# Altium project Shift Relay.PrjPcb
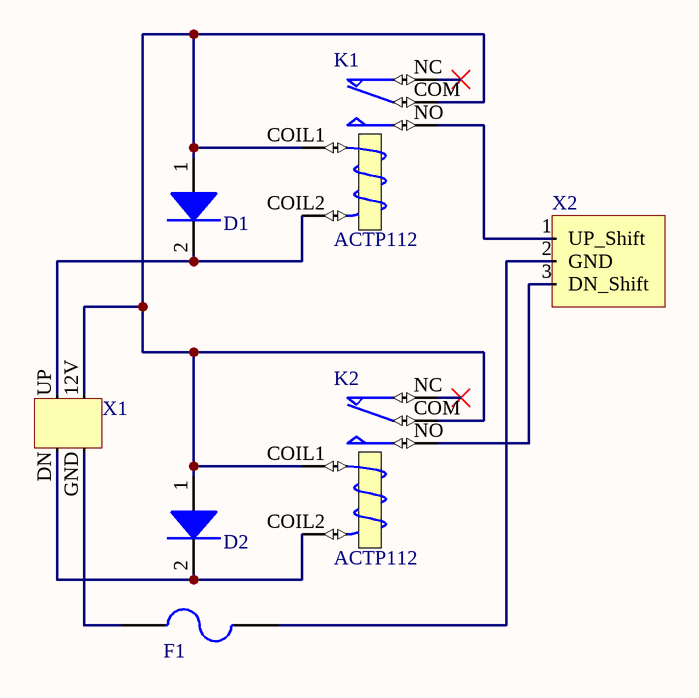
[diagram p0: shift_relays.SchDoc]
1 sheet, 7 parts. Net scope: global (net labels, ports and power ports of the same name join across sheets).

## Sheet shift_relays.SchDoc
size A

### Parts
D1  *  [DO214AA_ SD560BTR]  (value not drawn)
D2  *  [DO214AA_ SD560BTR]  (value not drawn)
F1  Fuse  [3568-MiniFuseHolder]  (value not drawn)
K1  ACTP112  [ACTP112]
K2  ACTP112  [ACTP112]
X1  *  [DTF13-4P]  (value not drawn)
X2  (no value)  [CONN_Shift]

### Nets
NetD1_1: D1.1(A) D2.1(A) K1.COIL1(T1) K1.COM K2.COIL1(T1) K2.COM X1.12V
NetD1_2: D1.2(K) K1.COIL2(T2) X1.UP
NetD2_2: D2.2(K) K2.COIL2(T2) X1.DN
NetF1_1: F1.1 X1.GND
NetF1_2: F1.2 X2.2(GND)
NetK1_NO: K1.NO X2.1(UP_Shift)
NetK2_NO: K2.NO X2.3(DN_Shift)

Not connected (* = marked no-connect by the designer): K1 NC*; K2 NC*

### Library data of the parts
D1 D2 = 18: Diode Standard 600V 5A Surface Mount SMB; id: 18; name: SD560BTR; mfrpartno: *; package: SMB; quantity: 0; link: https://www.digikey.com/product-detail/en/smc-diode-solutions/SD560BTR/1655-1530-1-ND/6022975
F1 = 3: id: 3; Name: 3568 Mini Fuse Holder; itrip: 0; iinterrupt: 0; vmax: 0; quantity: 0; link: https://www.digikey.com/product-detail/en/keystone-electronics/3568/36-3568-ND/2137306
K1 K2 = 1: id: 1; current: 0; voltage: 12; Published: 8-Jun-2000; LatestRevisionDate: 17-Jul-2002; LatestRevisionNote: Re-released for DXP Platform.; PackageReference: MODULE5B; Publisher: Altium Limited; name: ACTP112; quantity: 0; link: https://www.digikey.com/product-detail/en/panasonic-electric-works/ACTP112/255-5163-ND/4691838; createdby: Kevin
X1 = 15: DTF13-4P; id: 15; numcontacts: 4; MfrPartNo: *; name: DTF13-4P; quantity: 0; link: https://www.te.com/usa-en/product-DTF13-4P.html
X2 = 31: Connector for Shift Relays; id: 31; numcontacts: 3; name: CONN Shift; quantity: 0; createdby: Patrick